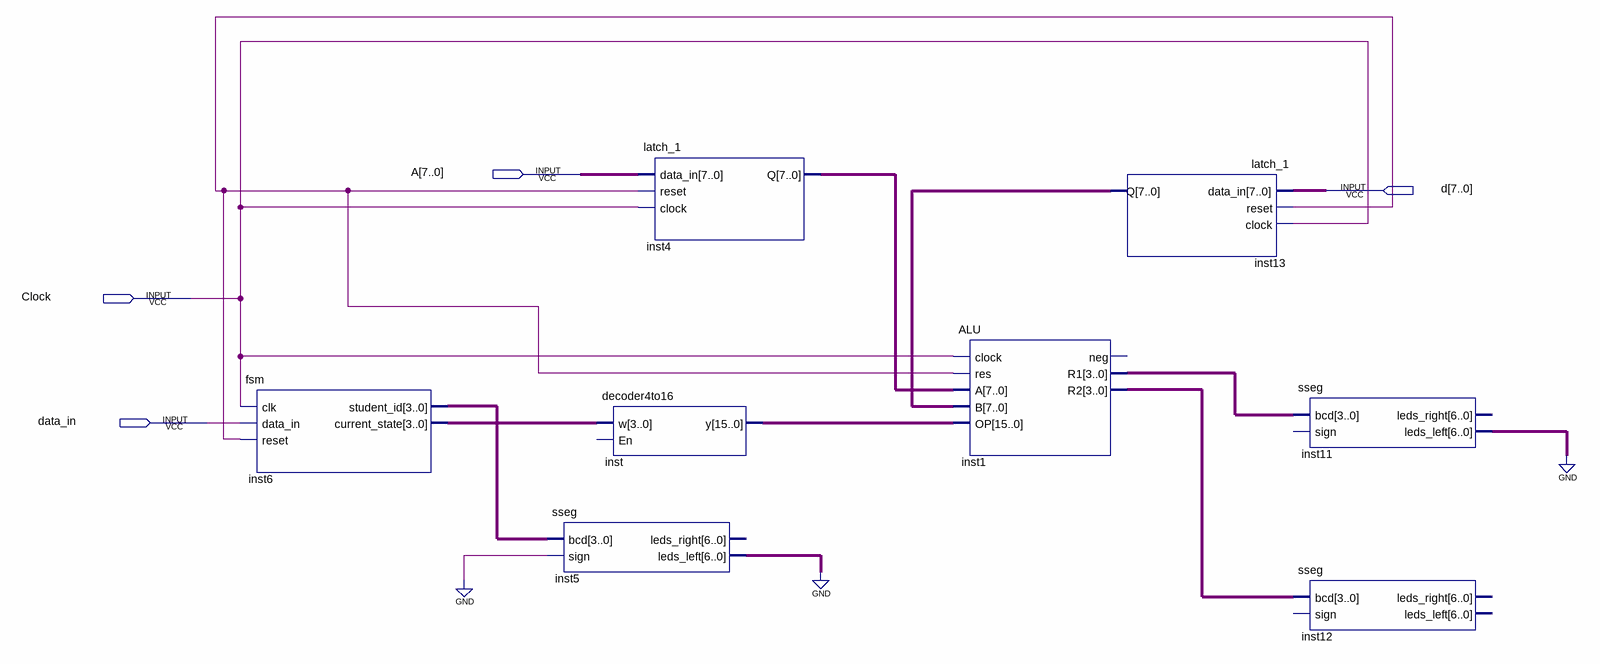
[diagram p0: schematic sheet]
// Quartus schematic ALU_Problem1.bdf as structural Verilog: 8 symbols, 4 pins
module ALU_Problem1 (
  input  [7:0] A,
  input  [7:0] d,
  input  Clock,
  input  data_in
);

  wire undriven;
  wire [3:0] inst1_r1, inst1_r2, inst6_current_state, inst6_student_id;
  wire [6:0] inst5_leds_left, inst11_leds_left;
  wire [7:0] inst4_q, inst13_q;
  wire [15:0] inst_y;

  fsm inst6 (
    .clk(Clock), .data_in(data_in), .reset(undriven), .student_id(inst6_student_id),
    .current_state(inst6_current_state));
  sseg inst5 (.bcd(inst6_student_id), .sign(1'b0), .leds_left(inst5_leds_left));  // open: leds_right
  latch_1 inst4 (.data_in(A), .reset(undriven), .clock(Clock), .Q(inst4_q));
  decoder4to16 inst (.w(inst6_current_state), .y(inst_y));  // open: En
  ALU inst1 (
    .clock(Clock), .res(undriven), .A(inst4_q), .B(inst13_q), .OP(inst_y), .R1(inst1_r1), .R2(inst1_r2));  // open: neg
  latch_1 inst13 (.data_in(d), .reset(undriven), .clock(Clock), .Q(inst13_q));
  sseg inst11 (.bcd(inst1_r1), .leds_left(inst11_leds_left));  // open: sign, leds_right
  sseg inst12 (.bcd(inst1_r2));  // open: sign, leds_right, leds_left
  // also tied to GND on the sheet: {inst5_leds_left[0], inst5_leds_left[1], inst5_leds_left[2], inst5_leds_left[3], inst5_leds_left[4], inst5_leds_left[5], inst5_leds_left[6], inst11_leds_left[0], inst11_leds_left[1], inst11_leds_left[2], inst11_leds_left[3], inst11_leds_left[4], inst11_leds_left[5], inst11_leds_left[6]}
endmodule
